# EAGLE schematic EMA - Base Piso 1 v1 (EAGLE 9.7.0)
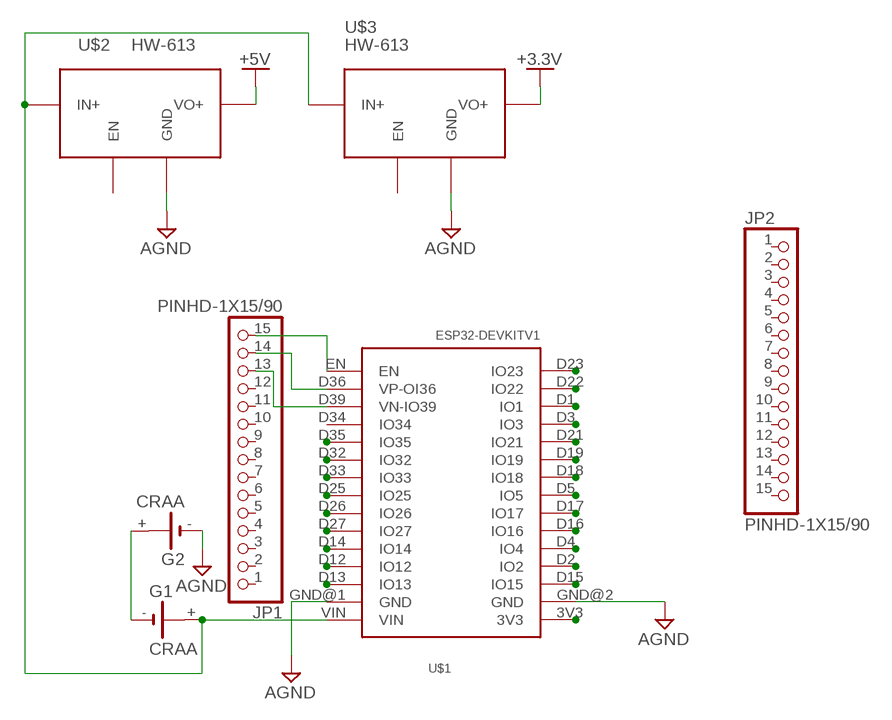
[diagram p0: schematic, sheet 1]

## Parts
G1  CRAA  [CRAA]
G2  CRAA  [CRAA]
JP1  PINHD-1X15/90  [1X15/90]
JP2  PINHD-1X15/90  [1X15/90]
U$1  ESP32DEVKITV1  [ESP32-DEVKITV1]
U$2  HW-613  [HW-613]
U$3  HW-613  [HW-613]

## Nets
+3.3V: U$3.VO+
+5V: U$2.VO+
AGND: G2.- U$1.GND@1(GND) U$1.GND@2(GND) U$2.GND U$3.GND
N$1: G1.- G2.+
N$2: G1.+ U$1.VIN U$2.IN+ U$3.IN+
N$3: U$1.3V3
N$4: JP1.15 U$1.EN
N$5: JP1.14 U$1.D36(VP-OI36)
N$8: U$1.D35(IO35)
N$9: U$1.D32(IO32)
N$10: U$1.D33(IO33)
N$11: U$1.D25(IO25)
N$12: U$1.D26(IO26)
N$13: U$1.D27(IO27)
N$14: U$1.D14(IO14)
N$15: U$1.D12(IO12)
N$16: U$1.D13(IO13)
N$18: JP1.13 JP2.9 U$1.D39(VN-IO39)
N$31: U$1.D23(IO23)
N$32: U$1.D22(IO22)
N$33: U$1.D1(IO1)
N$34: U$1.D3(IO3)
N$35: U$1.D21(IO21)
N$36: U$1.D19(IO19)
N$37: U$1.D18(IO18)
N$38: U$1.D5(IO5)
N$39: U$1.D17(IO17)
N$40: U$1.D16(IO16)
N$41: U$1.D4(IO4)
N$42: U$1.D2(IO2)
N$43: U$1.D15(IO15)
Unconnected: G1.+@1(+) G2.+@1(+) JP1.1 JP1.2 JP1.3 JP1.4 JP1.5 JP1.6 JP1.7 JP1.8 JP1.9 JP1.10 JP1.11 JP1.12 JP2.1 JP2.2 JP2.3 JP2.4 JP2.5 JP2.6 JP2.7 JP2.8 JP2.10 JP2.11 JP2.12 JP2.13 JP2.14 JP2.15 U$1.D34(IO34) U$2.EN U$3.EN

## Library data of the parts
G1 G2 = battery:CRAA: LI BATTERY Varta
JP1 JP2 = Connector:PINHD-1X15: PIN HEADER; CATEGORY: CONNECTOR; SUB-CATEGORY: PIN-HEADER
U$1 = ESP32-DEVKITV1:ESP32DEVKITV1
U$2 U$3 = hw-613:HW-613: DC/DC Adjustable Step-Down Regulator based on MP2315 chip